# EAGLE design LTC3112_buck-boost (EAGLE 6.3)
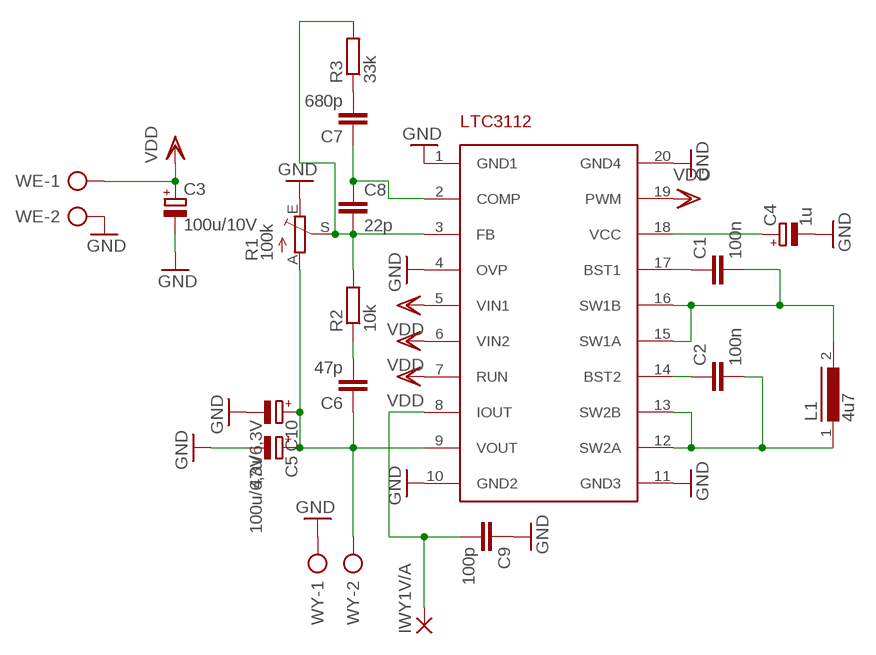
[diagram p0: schematic, sheet 1]

## Parts
C1  100n  C-EUC0603K  [C0603K]
C2  100n  C-EUC0603K  [C0603K]
C3  100u/10V  CPOL-EUE2.5-6  [E2,5-6]
C4  1u  CPOL-EUSMCB  [SMC_B]
C5  100u/6,3V  CPOL-EUE2.5-7  [E2,5-7]
C6  47p  C-EUC0805  [C0805]
C7  680p  C-EUC0805  [C0805]
C8  22p  C-EUC0805  [C0805]
C9  100p  C-EUC0805  [C0805]
C10  47u/6,3V  CPOL-EUE1.8-4  [E1,8-4]
IWY1V/A  1,6/0,8  [1,6/0,8]
L1  4u7  DR73  [DR73]
R1  100k  TRIM_EU-RJ9W  [RJ9W]
R2  10k  R-EU_R0805  [R0805]
R3  33k  R-EU_R0805  [R0805]
U$1  LTC3112  [TSSOP20]
WE  AK300/2  [AK300/2]
WY  AK300/2  [AK300/2]

## Nets
GND: C3.- C4.- C5.- C9.1 C10.- R1.E U$1.1(GND1) U$1.4(OVP) U$1.10(GND2) U$1.11(GND3) U$1.20(GND4) WE.2 WY.1
N$1: C1.1 U$1.17(BST1)
N$2: C2.1 U$1.14(BST2)
N$4: C1.2 L1.2 U$1.15(SW1A) U$1.16(SW1B)
N$5: C4.+ U$1.18(VCC)
N$6: C6.2 R2.1
N$7: C5.+ C6.1 C10.+ R1.A U$1.9(VOUT) WY.2
N$8: C8.2 R1.S R2.2 R3.2 U$1.3(FB)
N$9: C7.2 R3.1
N$10: C7.1 C8.1 U$1.2(COMP)
N$11: C9.2 IWY1V/A.1(P) U$1.8(IOUT)
N$13: C2.2 L1.1 U$1.12(SW2A) U$1.13(SW2B)
VDD: C3.+ U$1.5(VIN1) U$1.6(VIN2) U$1.7(RUN) U$1.19(PWM) WE.1

## Library data of the parts
C1 C2 C6-C9 = resistor:C-EU: CAPACITOR, European symbol
C3-C5 C10 = rcl:CPOL-EU: POLARIZED CAPACITOR, European symbol
IWY1V/A = wirepad:1,6/0,8: THROUGH-HOLE PAD
L1 = inductors:DR73: High Power Density, High Efficiency, Shielded Inductors Source: coiltronics_dr_series.pdf
R1 = pot:TRIM_EU-: POTENTIOMETER
R2 R3 = resistor:R-EU_: RESISTOR, European symbol
U$1 = ref-packages:LTC3112
WE WY = con-ptr500:AK300/2: CONNECTOR; OC_FARNELL: unknown; OC_NEWARK: unknown

## Net classes
0 default: clearance 0.7 mm

## Board
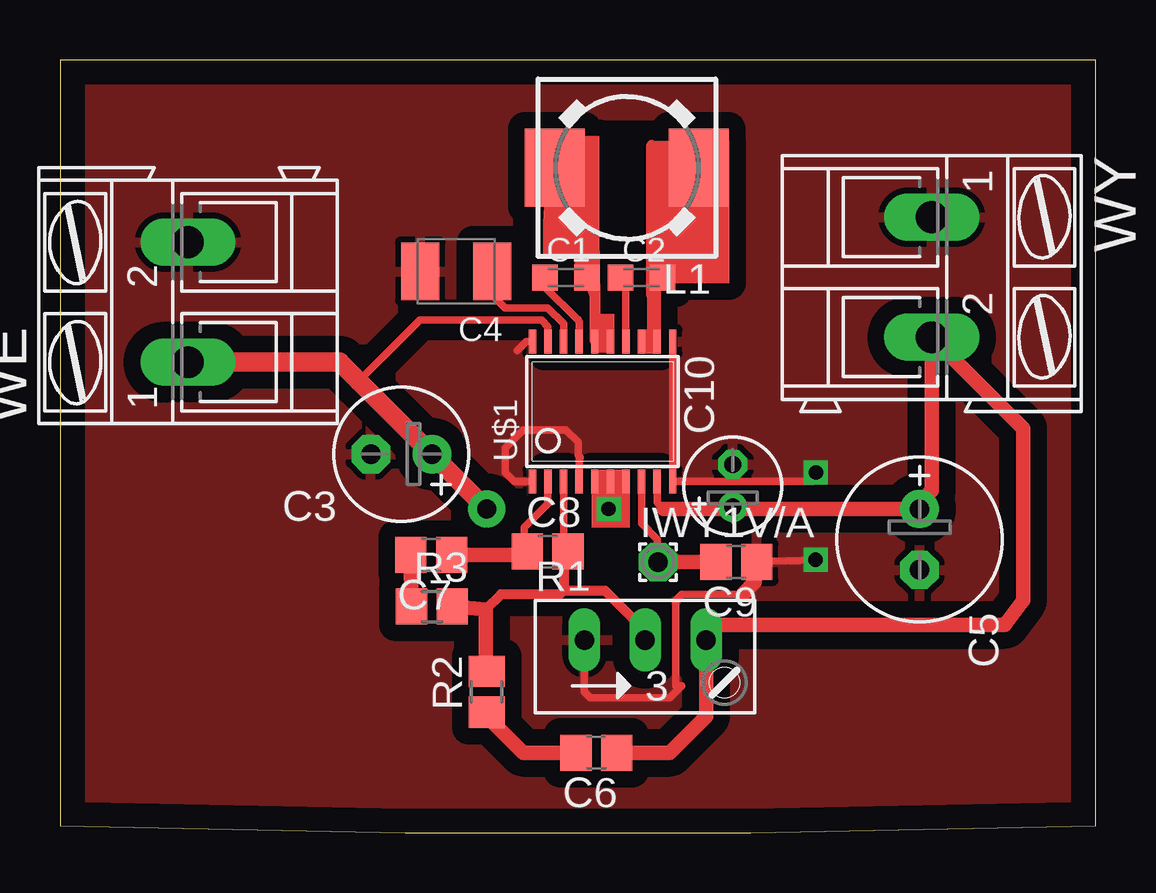
[diagram p1: board, top side]
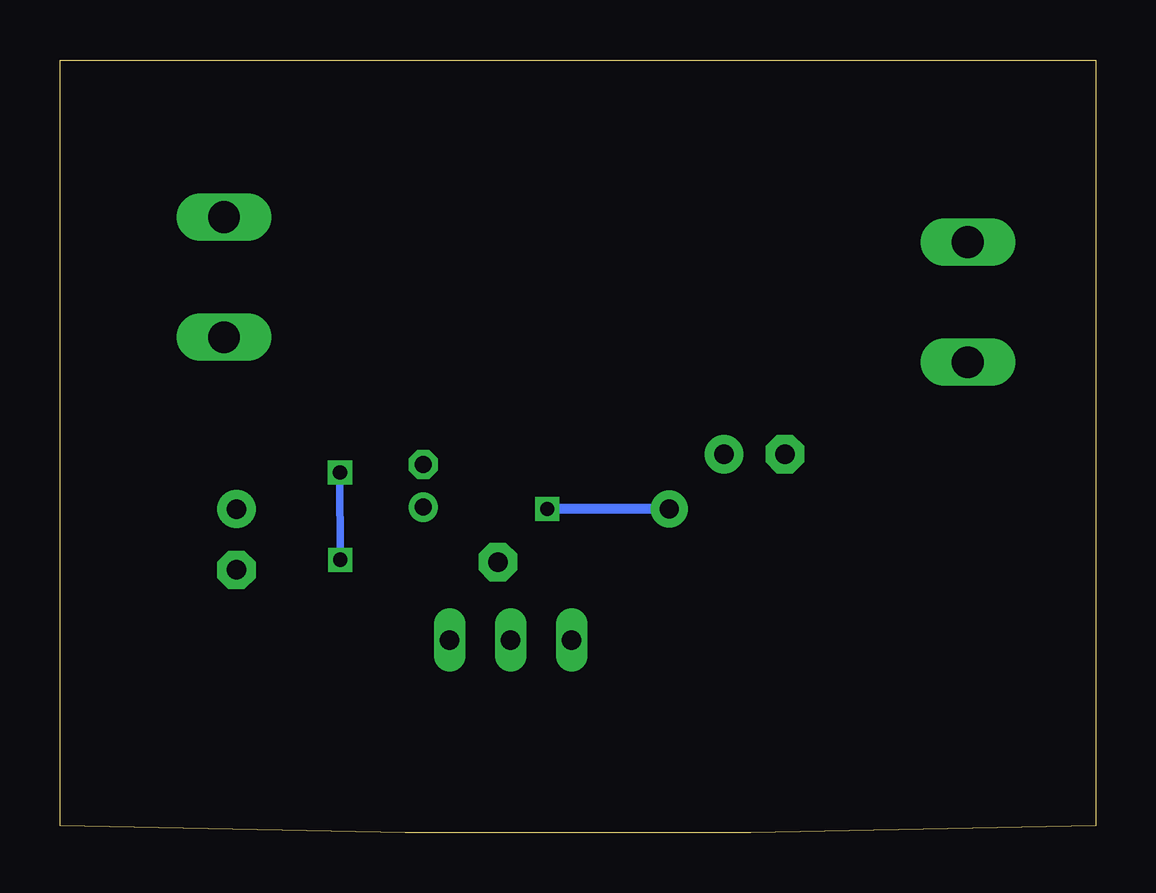
[diagram p2: board, bottom side, seen from below]

Size 43.16 x 32.23 mm. Coordinates in mm from the lower left corner, seen from the top.
Outline: 0,0.3 arc4 43.16,0.3 43.16,32.23 0,32.23 0,0.3
Copper layers (1*16): Top 0.035mm / dielectric 1.5mm / Bottom 0.035mm
Design rules "default": minimum track width 10mil, minimum drill 24mil, track to track 8mil, track to pad 8mil, pad to pad 8mil, via to via 8mil, smd to smd 8mil, copper to edge 40mil, drill to drill 8mil, minimum pad ring 10mil, minimum via ring 8mil, stop-mask expansion 4mil, vias tented up to drill 0mil, thermal gap 10mil

### Footprints (pad centres in the part's own frame; a part is rotated, then mirrored left to right if it is on the bottom)
C0603K = smd 1.05 x 1.08: 1 -0.875,0; 2 0.875,0
E2,5-6 = drill 0.813 pad 1.6: + -1.27,0 | drill 0.813 pad 1.6 octagon: - 1.27,0
SMC_B = smd 1.6 x 2.4: + -1.5,0; - 1.5,0
E2,5-7 = drill 0.813 pad 1.6: + -1.27,0 | drill 0.813 pad 1.6 octagon: - 1.27,0
C0805 = smd 1.3 x 1.5: 1 -0.85,0; 2 0.85,0
E1,8-4 = drill 0.711 pad 1.168: + -0.889,0 | drill 0.711 pad 1.168 octagon: - 0.889,0
1,6/0,8 = drill 0.813 pad 1.6 octagon: 1 0,0
DR73 = smd 2.5 x 3.25: 1 -3,0; 2 3,0
RJ9W = drill 0.813 long: A 2.54,0.635; E -2.54,0.635; S 0,0.635
R0805 = smd 1.3 x 1.5: 1 -0.85,0; 2 0.85,0
TSSOP20 = smd 0.305 x 0.991: 1 -2.925,-2.918; 2 -2.275,-2.918; 3 -1.625,-2.918; 4 -0.975,-2.918; 5 -0.325,-2.918; 6 0.325,-2.918; 7 0.975,-2.918; 8 1.625,-2.918; 9 2.275,-2.918; 10 2.925,-2.918; 11 2.925,2.918; 12 2.275,2.918; 13 1.625,2.918; 14 0.975,2.918; 15 0.325,2.918; 16 -0.325,2.918; 17 -0.975,2.918; 18 -1.625,2.918; 19 -2.275,2.918; 20 -2.925,2.918
AK300/2 = drill 1.321 long: 1 -2.515,0; 2 2.489,0

### Placement (x,y rotation side)
C1  21.08,23.16 0 top
C2  24.23,23.16 0 top
C3  14.22,15.79 180 top
C4  16.51,23.41 180 top
C5  35.81,12.24 270 top
C6  22.35,3.35 180 top
C7  15.47,11.59 180 top
C8  20.32,11.73 0 top
C9  28.18,11.3 180 top
C10  28.03,14.47 90 top
IWY1V/A  24.92,11.3 0 top
L1  23.62,27.73 180 top
R1  24.38,7.41 0 top
R2  17.78,5.89 90 top
R3  15.49,9.44 0 top
U$1  22.61,17.57 0 top
WE  5.33,22.14 90 top
WY  36.32,23.16 270 top

### Tracks (layer width: path | path; a pad name or v marks a point on that pad's centre or on a via)
GND  (via drill 0.6)
  Top 0.305: v31.5,15.03 31.37,14.65 U$1.10 U$1.11 | v31.48,11.39 C9.1 28.96,11.39 | R1.E 21.84,5.89 22.1,5.63 25.4,5.63 25.91,6.14 25.65,6.14 25.65,9.7 25.91,9.95 28.45,9.95 | U$1.1 18.92,14.65 18.54,15.03 18.54,16.05 19.3,16.81 21.08,16.81 21.59,16.3 21.59,15.74 21.68,15.65 21.65,15.65 21.63,15.63 U$1.4 | U$1.20 19.43,20.49 19.05,20.11
  Top 0.61: 28.45,9.95 28.96,10.46
  Bottom 0.305: v31.5,15.03 v31.48,11.39
  pour Top: -2.54,-3 43.18,-3 42.93,36.62 -2.79,36.62
N$1
  Top 0.305: C1.1 20.21,22.76 21.59,21.38 21.6,21.39 21.6,21.36 21.63,21.33 U$1.17
N$2
  Top 0.305: U$1.14 23.58,22.93 C2.1
N$4
  Top 0.305: U$1.15 U$1.16 22.29,20.49 | 20.32,24.43 20.32,26.46 | C1.2 22.22,22.4 22.29,22.46
  Top 0.406: 22.29,20.49 22.29,22.46
  Top 0.61: C1.2 21.96,23.81 21.34,24.43 21.34,25.44 20.32,26.46 20.32,26.92 L1.2
N$5
  Top 0.305: U$1.18 20.98,21.23 20.32,21.89 18.54,21.89 18.03,22.4 18.03,23.39 C4.+
N$6
  Top 0.61: R2.1 17.78,4.87 19.3,3.35 C6.2
N$7
  Top 0.305: U$1.9 24.88,13.77 25.15,13.51 28.07,13.51 C10.+
  Top 0.61: 25.15,13.51 C5.+ 35.56,13.51 36.32,14.27 WY.2 40.13,16.86 40.13,9.7 39.37,8.68 27,8.68 R1.A 26.92,4.87 25.4,3.35 C6.1
N$8
  Top 0.305: U$1.3 20.98,11.74 C8.2
  Top 0.406: 20.98,11.74 20.98,10.1 | 20.98,10.1 20.83,9.95 18.38,9.95 17.74,9.32 | 20.98,10.1 22.71,10.1 24.13,8.68 24.13,8.3 R1.S
  Top 0.61: R3.2 17.74,9.32 17.74,6.77 R2.2
N$9
  Top 0.61: C7.2 R3.1
N$10
  Top 0.305: U$1.2 20.33,13.72 19.34,12.73 19.34,11.7 C8.1 19.23,11.59
  Top 0.61: C7.1 19.23,11.59
N$11
  Top 0.305: U$1.8 24.23,12.9 24.89,12.24 IWY1V/A.1
  Top 0.61: IWY1V/A.1 C9.2
N$13
  Top 0.305: U$1.13 U$1.12 24.88,22.93 C2.2 25.26,22.76 26.92,24.43 26.92,27.17 L1.1
N$15
  Top 0.406: 20.55,25.15 20.5,25.15 20.69,25.72
N$16
  Top 0.406: 24.64,22.4 24.64,28.68
VDD  (via drill 0.6, 0.8 pad 1.55)
  Top 0.305: U$1.7 U$1.6 U$1.5 22.91,14.65 22.94,14.62 | U$1.19 20.33,21.12 20.07,21.38 14.99,21.38 12.45,18.84
  Top 0.406: v22.86,13.51 22.86,14.58 U$1.6
  Top 0.813: WE.1 11.66,19.63 12.45,18.84 C3.+ v17.78,13.51
  Bottom 0.406: v17.78,13.51 v22.86,13.51
(copper drawn outside any net)
  shapes: Top area x16